# EAGLE schematic RoboSkin (EAGLE 9.5.2)
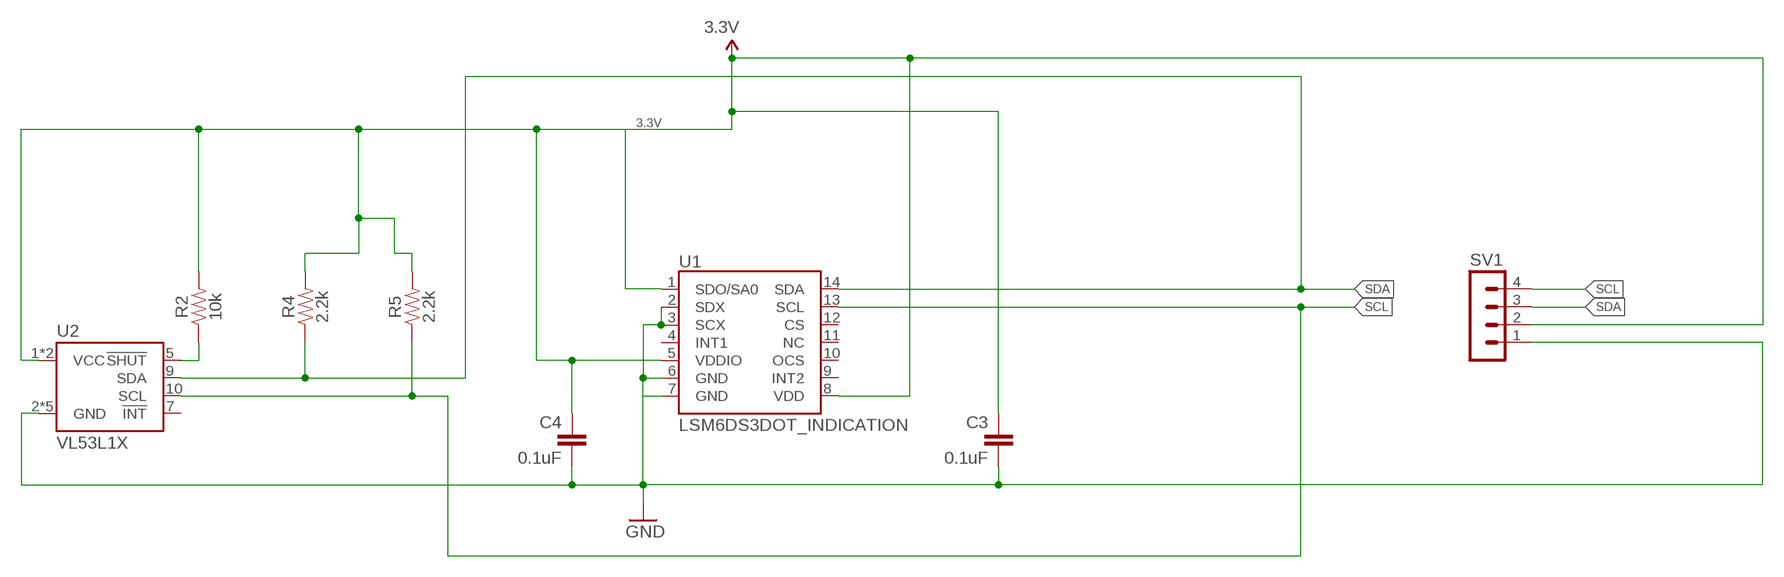
[diagram p0: schematic, sheet 1]

## Parts
C3  0.1uF  0.1UF-100V-10%(0603)  [0603-CAP]
C4  0.1uF  0.1UF-100V-10%(0603)  [0603-CAP]
R2  10k  10KOHM-0603-1/10W-1%  [0603]
R4  2.2k  2.2KOHM-0603-1/10W-1%  [0603]
R5  2.2k  2.2KOHM-0603-1/10W-1%  [0603]
SV1  MA04-1  [MA04-1]
U1  LSM6DS3DOT_INDICATION  [LGA14L_DOT_INDICATOR]
U2  VL53L1X  VL53L1XSMD  [VL53L1X]

## Nets
3.3V: C3.1 C4.1 R2.2 R4.2 R5.2 SV1.2 U1.1(SDO/SA0) U1.5(VDDIO) U1.8(VDD) U2.1(VCC) U2.11(VCC)
!SHUT: R2.1 U2.5(!SHUT)
GND: C3.2 C4.2 SV1.1 U1.2(SDX) U1.3(SCX) U1.6(GND) U1.7(GND) U2.2(GND) U2.3(GND) U2.4(GND) U2.6(GND) U2.12(GND)
SCL: R5.1 SV1.4 U1.13(SCL) U2.10(SCL)
SDA: R4.1 SV1.3 U1.14(SDA) U2.9(SDA)
Unconnected: U1.4(INT1) U1.9(INT2) U1.10(OCS) U1.11(NC) U1.12(CS) U2.7(!INT)

## Library data of the parts
C3 C4 = SparkFun-Capacitors:0.1UF-100V-10%(0603): CAP-08390; PROD_ID: CAP-08390
R2 = SparkFun-Resistors:10KOHM: 10kΩ resistor A resistor is a passive two-terminal electrical component that implements electrical resistance as a circuit element. Resistors act to reduce current flow, and, at the same time, act to lower voltage levels within circuits. - Wikipedia; PROD_ID: RES-00824
R4 R5 = SparkFun-Resistors:2.2KOHM: 2.2kΩ resistor A resistor is a passive two-terminal electrical component that implements electrical resistance as a circuit element. Resistors act to reduce current flow, and, at the same time, act to lower voltage levels within circuits. - Wikipedia; PROD_ID: RES-08272
SV1 = con-lstb:MA04-1: PIN HEADER; OC_FARNELL: unknown; OC_NEWARK: unknown
U1 = LSM6DS3:LSM6DS3; PROD_ID: IC-12969
U2 = SparkFun-Sensors:VL53L1X: STMicroelectronics VL53L1X - 400 cm IR Laser ToF Sensor VL53L1X is a state-of-the-art ToF laser-ranging sensor, enhancing the ST FlightSense product family. It is the fastest miniature ToF sensor currently on the market with accurate ranging up to 4 m and fast ranging frequency (up to 50 Hz). Housed in a miniature and reflowable package, it integrates a single photon avalanche diode (SPAD) receiving array, a 940 nm invisible laser Class 1 emitter, physical infrared filters, and optics to achieve the best ranging performance in various ambient lighting conditions with a range of cover window options.; PROD_ID: IC-13960

## Net classes
0 default: clearance 0.205 mm